# Altium schematic sheet sensors.SchDoc
size A4; SheetNumber: 2; SheetTotal: 3
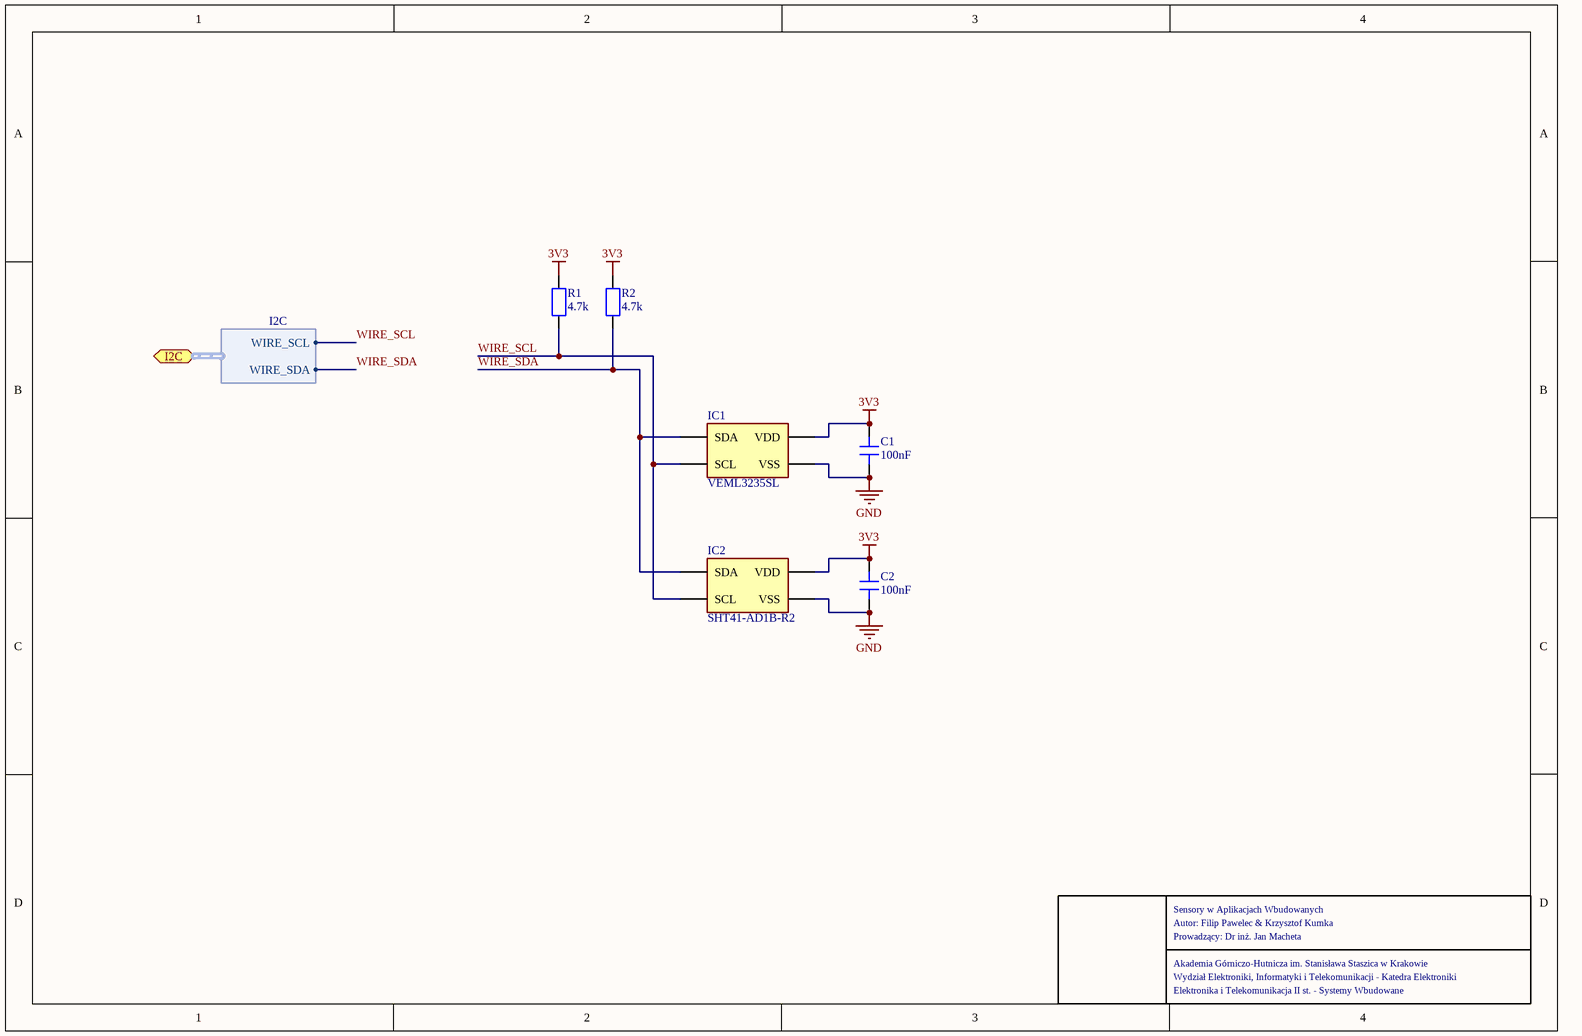
[diagram p0: sensors.SchDoc]

## Parts
C1  100nF  [C0603]
C2  100nF  [C0603]
IC1  VEML3235SL  [VEML3235SL]
IC2  SHT41-AD1B-R2  [SHT41AD1BR2]
R1  4.7k  [R0603]
R2  4.7k  [R0603]

## Ports
I2C (bidir, harness I2C)

## Harnesses
I2C: WIRE_SCL, WIRE_SDA

## Nets
3V3: C1.2 C2.2 IC1.1(VDD) IC2.3(VDD) R1.2 R2.2
GND: C1.1 C2.1 IC1.2(VSS) IC2.4(VSS)
WIRE_SCL: IC1.4(SCL) IC2.2(SCL) R1.1 ; port I2C.WIRE_SCL
WIRE_SDA: IC1.3(SDA) IC2.1(SDA) R2.1 ; port I2C.WIRE_SDA

## Notes on the sheet
- Autor: Filip Pawelec & Krzysztof Kumka
- Sensory w Aplikacjach Wbudowanych
- Akademia Górniczo-Hutnicza im. Stanisława Staszica w Krakowie
- Prowadzący: Dr inż. Jan Macheta
- Wydział Elektroniki, Informatyki i Telekomunikacji - Katedra Elektroniki
- Elektronika i Telekomunikacja II st. - Systemy Wbudowane

## Library data of the parts
C1 C2 = C0603: Capacitor; value: 100nF
IC1 = VEML3235SL: Integrated Circuit
IC2 = SHT41-AD1B-R2: Integrated Circuit; Manufacturer_Name: Sensirion; Datasheet Link: https://sensirion.com/media/documents/33FD6951/61641E1E/Sensirion_Humidity_Sensors_SHT4x_Datasheet.pdf; Height: 0.59mm; Manufacturer_Part_Number: SHT41-AD1B-R2
R1 R2 = R0603: Resistor; value: 4.7k